# EAGLE schematic Buck Regulator (EAGLE 9.6.2)

## Sheet 1 of 2
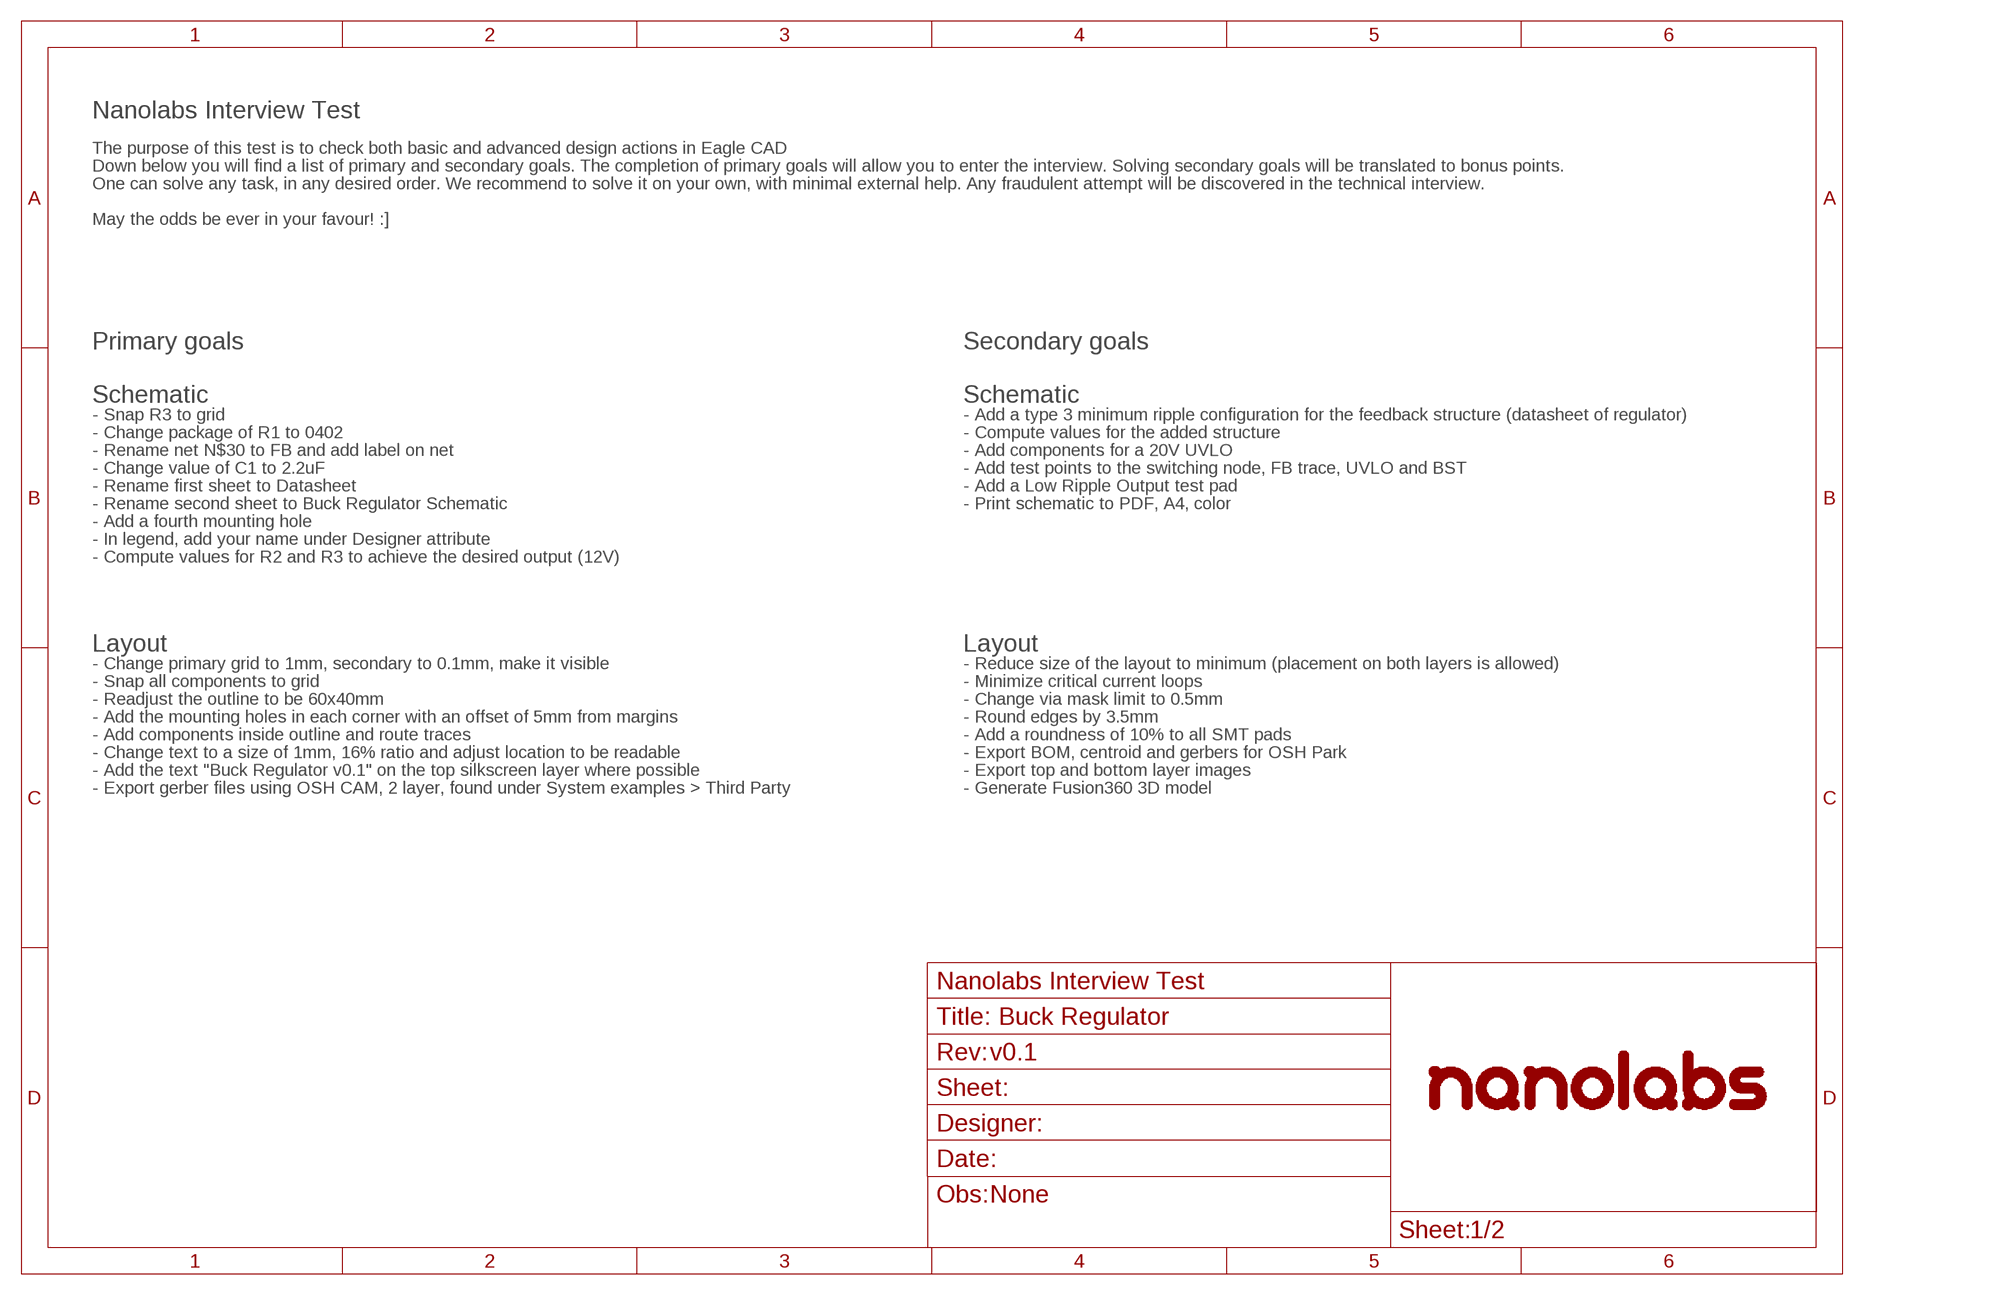
[diagram p0: schematic, sheet 1]
FRAME3 (_SCH_FRAME_A4): OBS: None; REVNUM: v0.1

### Notes on the sheet
- Nanolabs Interview Test
- The purpose of this test is to check both basic and advanced design actions in Eagle CAD
- Down below you will find a list of primary and secondary goals. The completion of primary goals will allow you to enter the interview. Solving secondary goals will be translated to bonus points.
- One can solve any task, in any desired order. We recommend to solve it on your own, with minimal external help. Any fraudulent attempt will be discovered in the technical interview.
- May the odds be ever in your favour! :]
- Primary goals | Secondary goals
- Schematic | Schematic
- - Snap R3 to grid | - Add a type 3 minimum ripple configuration for the feedback structure (datasheet of regulator)
- - Change package of R1 to 0402 | - Compute values for the added structure
- - Rename net N$30 to FB and add label on net | - Add components for a 20V UVLO
- - Change value of C1 to 2.2uF | - Add test points to the switching node, FB trace, UVLO and BST
- - Rename first sheet to Datasheet | - Add a Low Ripple Output test pad
- - Rename second sheet to Buck Regulator Schematic | - Print schematic to PDF, A4, color
- - Add a fourth mounting hole
- - In legend, add your name under Designer attribute
- - Compute values for R2 and R3 to achieve the desired output (12V)
- Layout | Layout
- - Change primary grid to 1mm, secondary to 0.1mm, make it visible | - Reduce size of the layout to minimum (placement on both layers is allowed)
- - Snap all components to grid | - Minimize critical current loops
- - Readjust the outline to be 60x40mm | - Change via mask limit to 0.5mm
- - Add the mounting holes in each corner with an offset of 5mm from margins | - Round edges by 3.5mm
- - Add components inside outline and route traces | - Add a roundness of 10% to all SMT pads
- - Change text to a size of 1mm, 16% ratio and adjust location to be readable | - Export BOM, centroid and gerbers for OSH Park
- - Add the text "Buck Regulator v0.1" on the top silkscreen layer where possible | - Export top and bottom layer images
- - Export gerber files using OSH CAM, 2 layer, found under System examples > Third Party | - Generate Fusion360 3D model

## Sheet 2 of 2
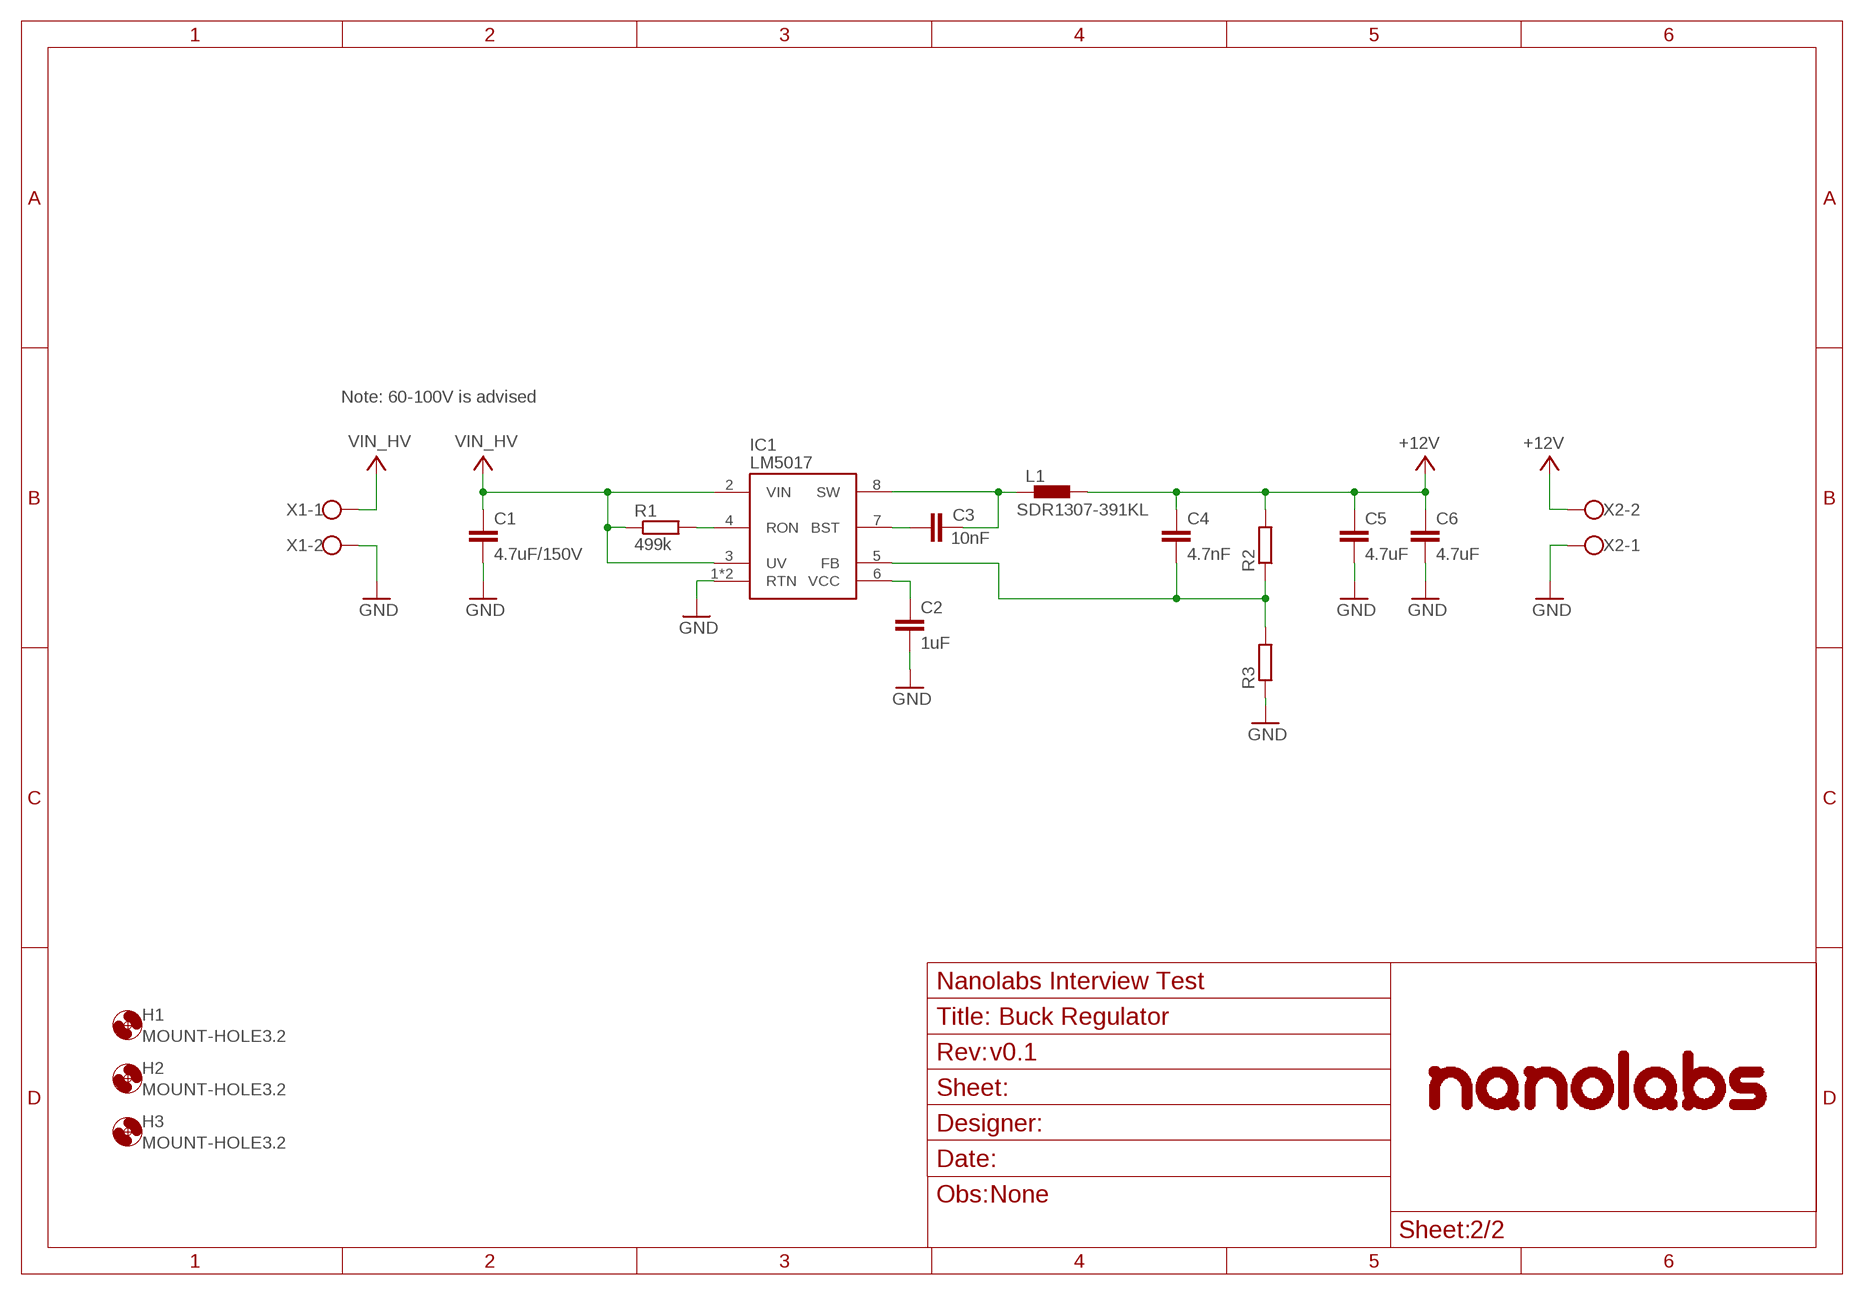
[diagram p1: schematic, sheet 2]
FRAME1 (_SCH_FRAME_A4): OBS: None; REVNUM: v0.1

### Parts
C1  4.7uF/150V  C-EUC1812  [C1812]
C2  1uF  C-EUC0603  [C0603]
C3  10nF  C-EUC0603  [C0603]
C4  4.7nF  C-EUC0603  [C0603]
C5  4.7uF  C-EUC0603  [C0603]
C6  4.7uF  C-EUC0603  [C0603]
H1  MOUNT-HOLE3.2  [3,2]
H2  MOUNT-HOLE3.2  [3,2]
H3  MOUNT-HOLE3.2  [3,2]
IC1  LM5017  [SO-08-EP]
L1  SDR1307-391KL  [SDR1307-391KL]
R1  499k  R-EU_R0603  [R0603]
R2  R-EU_R0603  [R0603]
R3  R-EU_R0603  [R0603]
X1  W237-102  [W237-102]
X2  W237-102  [W237-102]

### Nets
+12V: C4.1 C5.1 C6.1 L1.2 R2.2 X2.2
GND: C1.2 C2.2 C5.2 C6.2 IC1.1(RTN) IC1.9(RTN) R3.1 X1.2 X2.1
N$23: C2.1 IC1.6(VCC)
N$28: C3.1 IC1.7(BST)
N$29: C3.2 IC1.8(SW) L1.1
N$30: C4.2 IC1.5(FB) R2.1 R3.2
N$31: IC1.4(RON) R1.2
VIN_HV: C1.1 IC1.2(VIN) IC1.3(UV) R1.1 X1.1

### Notes on the sheet
- Note: 60-100V is advised

## Library data of the parts
C1-C6 = rcl:C-EU: CAPACITOR, European symbol; SPICEPREFIX: C
H1-H3 = _nanolabs_layout:MOUNT-HOLE: MOUNTING HOLE with drill center marker
IC1 = _nanolabs_ic:LM5017
L1 = _nanolabs_rcl:SDR1307-391KL
R1-R3 = rcl:R-EU_: RESISTOR, European symbol; SPICEPREFIX: R
X1 X2 = con-wago-500:W237-102: WAGO SCREW CLAMP; MPN: 237-102; OC_FARNELL: unknown; OC_NEWARK: 70K9898